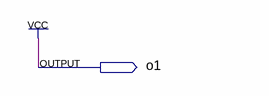
[diagram p0: schematic sheet]
// Quartus schematic vcc_1.bdf as structural Verilog: 0 symbols, 1 pins
module vcc_1 (
  output o1
);


  assign o1 = 1'b1;
endmodule
